# Altium schematic sheet 01_MICRO.SchDoc
size A3
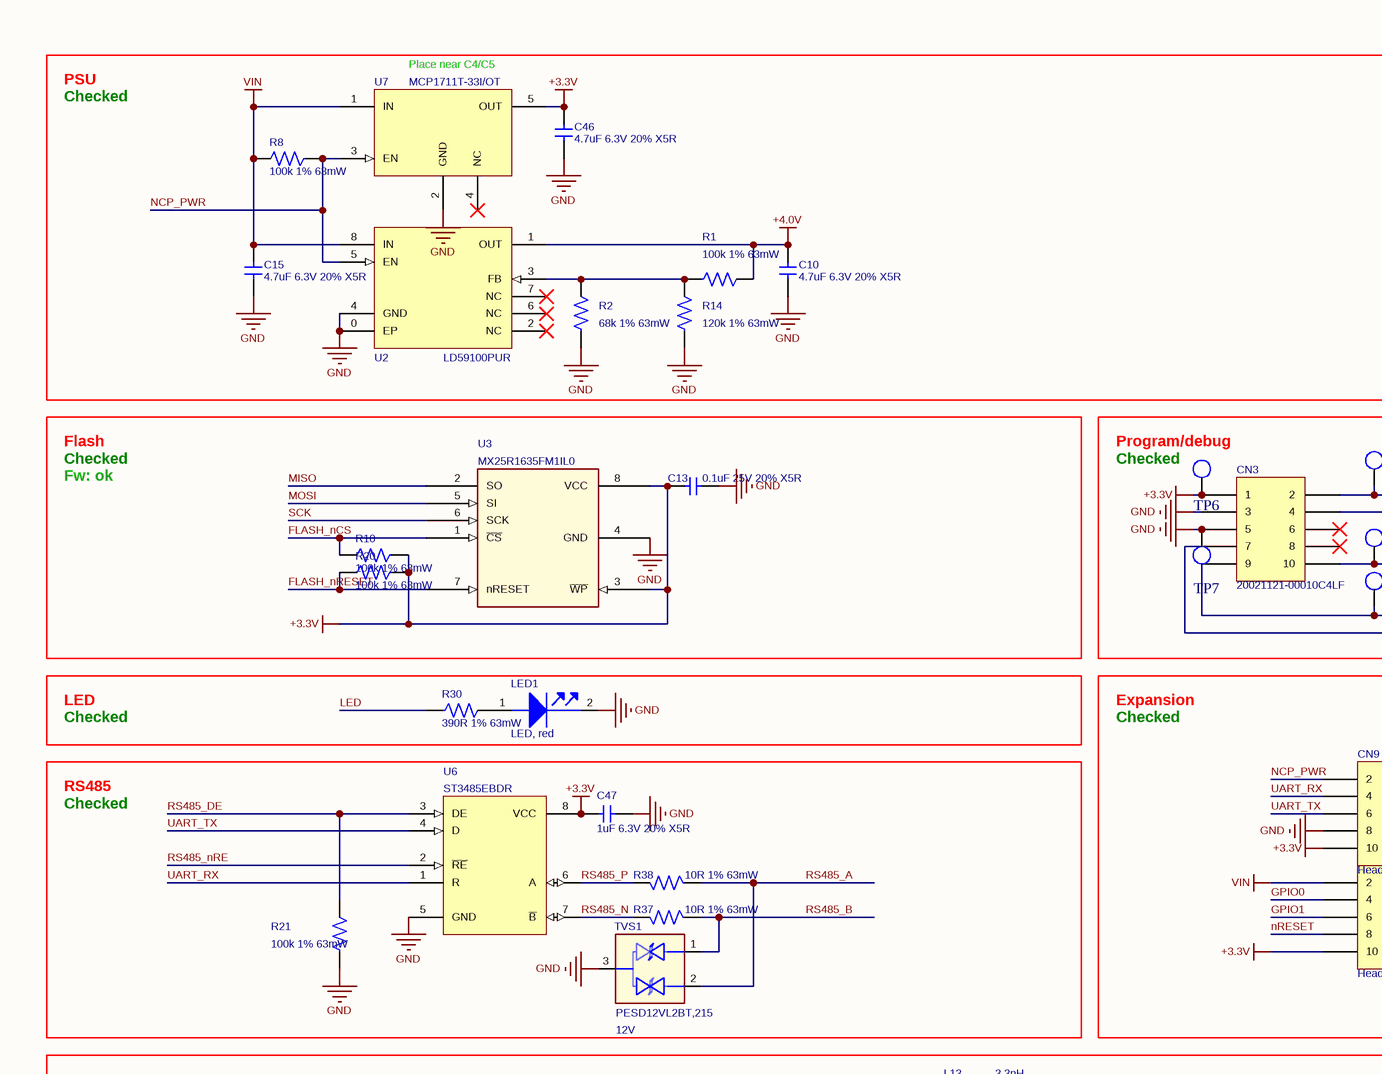
[diagram p0: 01_MICRO.SchDoc, top left]
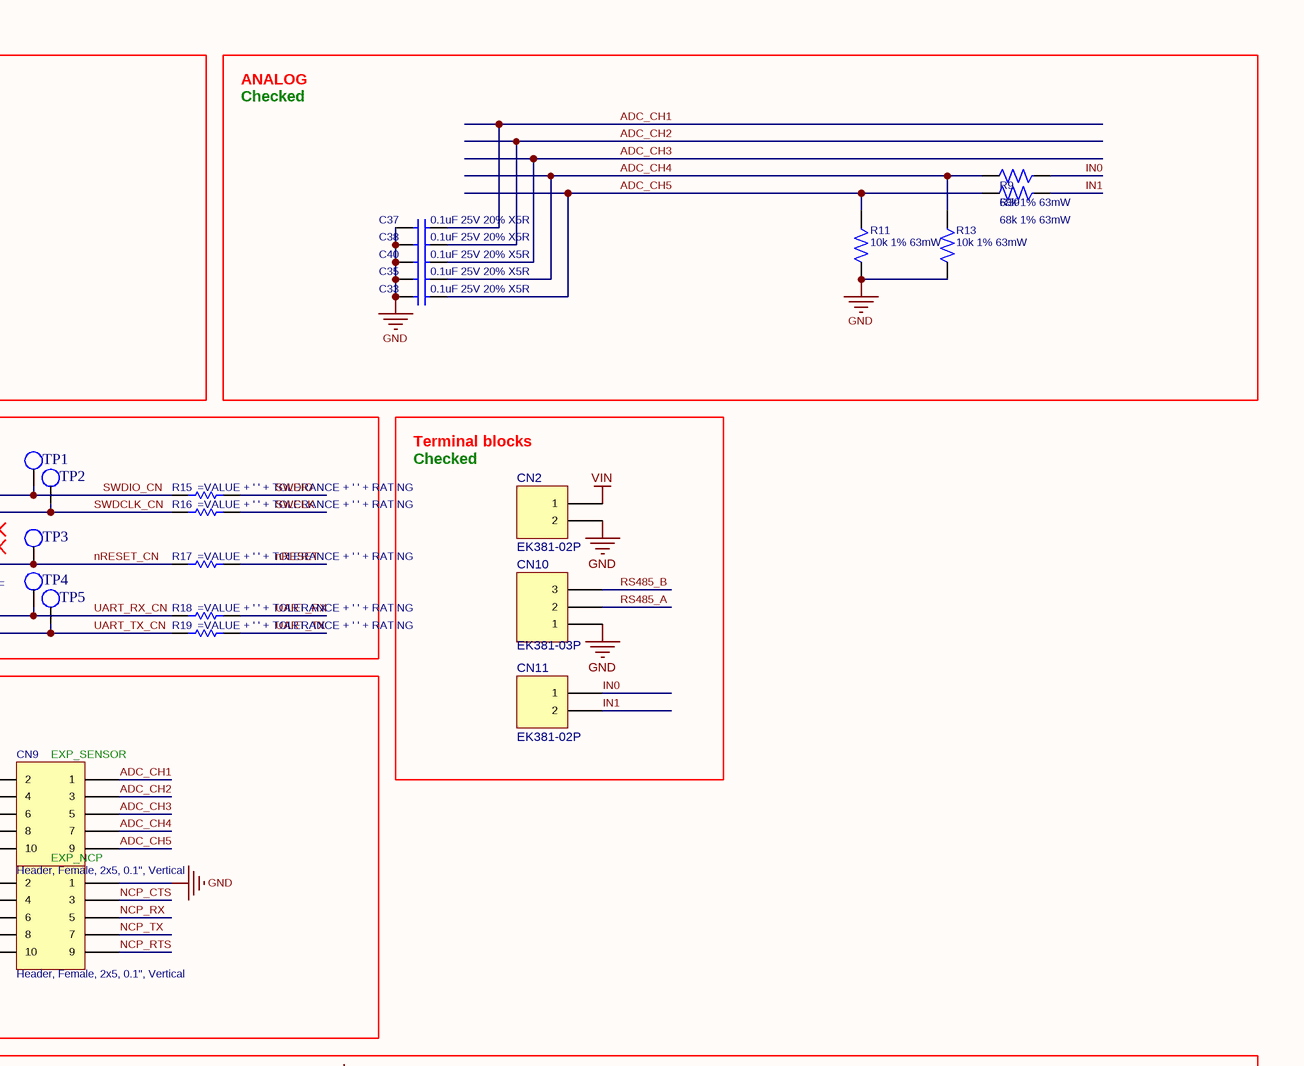
[diagram p1: 01_MICRO.SchDoc, top right]
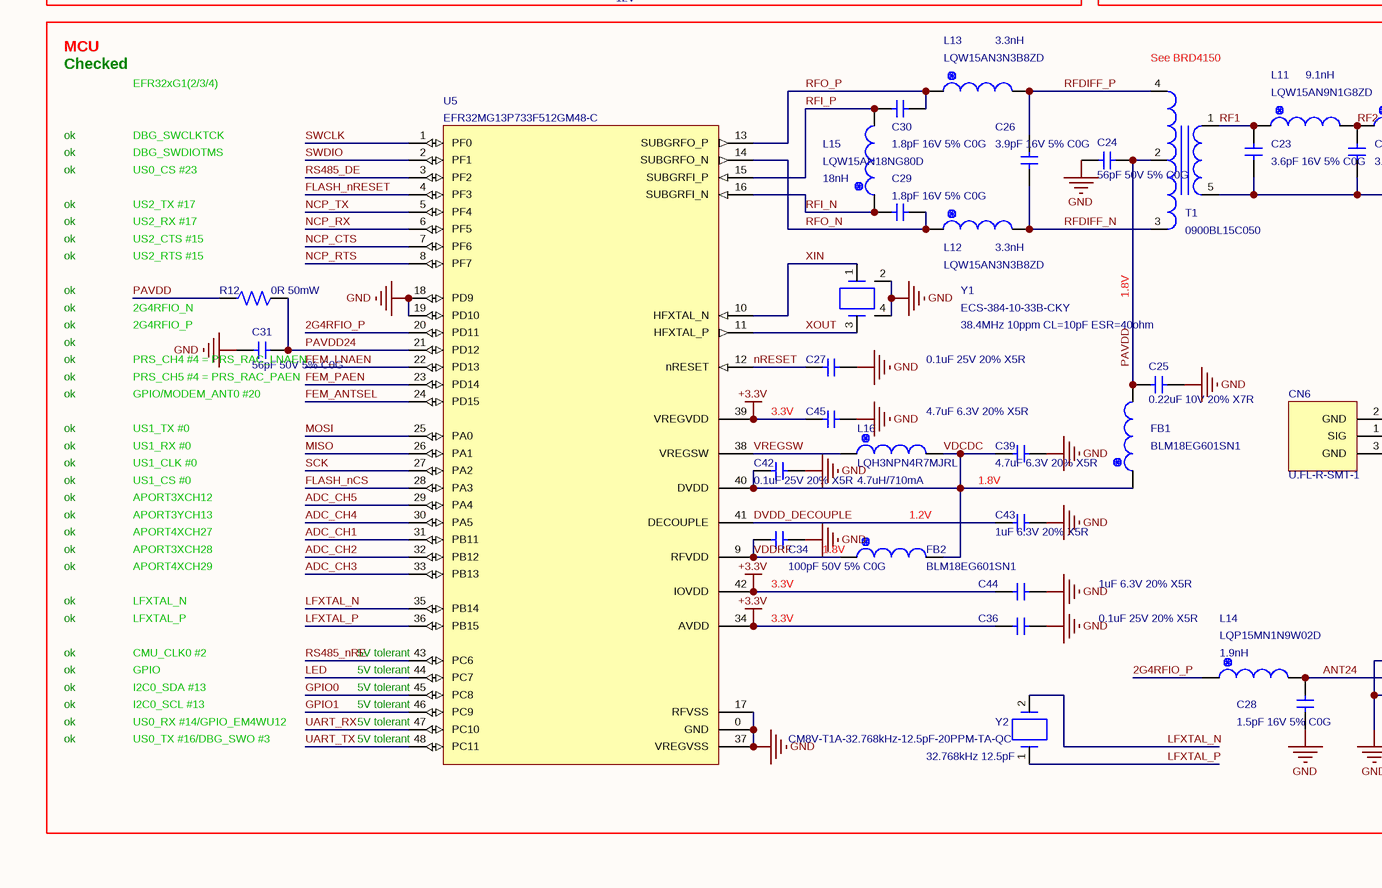
[diagram p2: 01_MICRO.SchDoc, bottom left]
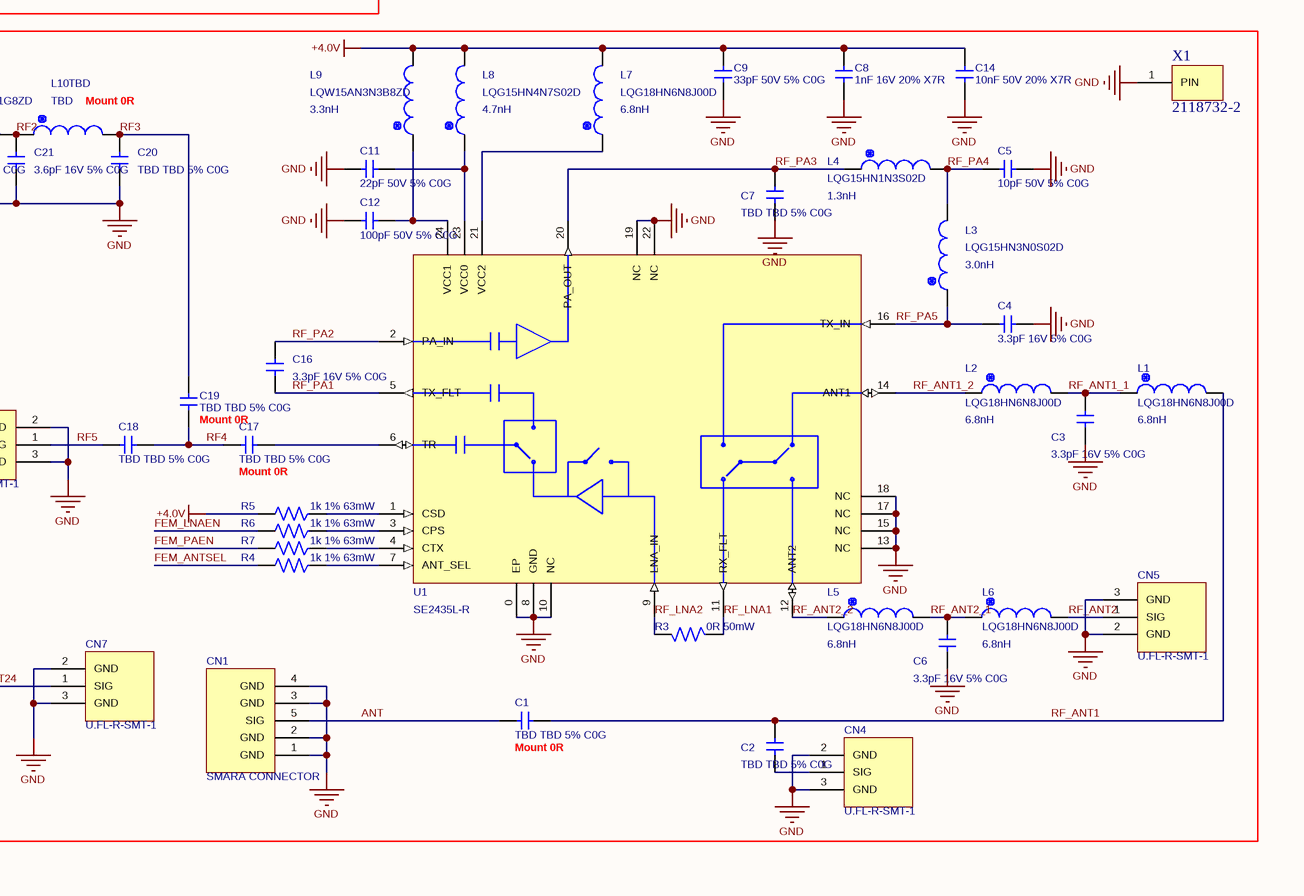
[diagram p3: 01_MICRO.SchDoc, bottom right]

## Parts
C1  TBD TBD 5% C0G  AssemblyComments: Mount 0R  [CAPC1005X55L]
C2  TBD TBD 5% C0G  [CAPC1005X55L]
C3  3.3pF 16V 5% C0G  [CAPC1005X55L]
C4  3.3pF 16V 5% C0G  [CAPC1005X55L]
C5  10pF 50V 5% C0G  [CAPC1005X55L]
C6  3.3pF 16V 5% C0G  [CAPC1005X55L]
C7  TBD TBD 5% C0G  [CAPC1005X55L]
C8  1nF 16V 20% X7R  [CAPC1005X55L]
C9  33pF 50V 5% C0G  [CAPC1005X55L]
C10  4.7uF 6.3V 20% X5R  [CAPC1608X90N]
C11  22pF 50V 5% C0G  [CAPC1005X55L]
C12  100pF 50V 5% C0G  [CAPC1005X55L]
C13  0.1uF 25V 20% X5R  [CAPC1005N]
C14  10nF 50V 20% X7R  [CAPC1005X55L]
C15  4.7uF 6.3V 20% X5R  [CAPC1608X90N]
C16  3.3pF 16V 5% C0G  [CAPC1005X55L]
C17  TBD TBD 5% C0G  AssemblyComments: Mount 0R  [CAPC1005X55L]
C18  TBD TBD 5% C0G  [CAPC1005X55L]
C19  TBD TBD 5% C0G  AssemblyComments: Mount 0R  [CAPC1005X55L]
C20  TBD TBD 5% C0G  [CAPC1005X55L]
C21  3.6pF 16V 5% C0G  [CAPC1005X55L]
C23  3.6pF 16V 5% C0G  [CAPC1005X55L]
C24  56pF 50V 5% C0G  [CAPC1005X55L]
C25  0.22uF 10V 20% X7R  [CAPC1005N]
C26  3.9pF 16V 5% C0G  [CAPC1005X55L]
C27  0.1uF 25V 20% X5R  [CAPC1005N]
C28  1.5pF 16V 5% C0G  [CAPC1005X55L]
C29  1.8pF 16V 5% C0G  [CAPC1005X55L]
C30  1.8pF 16V 5% C0G  [CAPC1005X55L]
C31  56pF 50V 5% C0G  [CAPC1005X55L]
C33  0.1uF 25V 20% X5R  [CAPC1005N]
C34  100pF 50V 5% C0G  [CAPC1005X55L]
C35  0.1uF 25V 20% X5R  [CAPC1005N]
C36  0.1uF 25V 20% X5R  [CAPC1005N]
C37  0.1uF 25V 20% X5R  [CAPC1005N]
C38  0.1uF 25V 20% X5R  [CAPC1005N]
C39  4.7uF 6.3V 20% X5R  [CAPC1608X90N]
C40  0.1uF 25V 20% X5R  [CAPC1005N]
C42  0.1uF 25V 20% X5R  [CAPC1005N]
C43  1uF 6.3V 20% X5R  [CAPC1005N]
C44  1uF 6.3V 20% X5R  [CAPC1005N]
C45  4.7uF 6.3V 20% X5R  [CAPC1608X90N]
C46  4.7uF 6.3V 20% X5R  [CAPC1608X90N]
C47  1uF 6.3V 20% X5R  [CAPC1005N]
CN1  SMARA CONNECTOR  [0733910320]
CN2  EK381-02P  [EK381-02P]
CN3  20021121-00010C4LF  [HDR2X5]
CN4  U.FL-R-SMT-1  [U.FL-R-SMT-1]
CN5  U.FL-R-SMT-1  [U.FL-R-SMT-1]
CN6  U.FL-R-SMT-1  [U.FL-R-SMT-1]
CN7  U.FL-R-SMT-1  [U.FL-R-SMT-1]
CN8  Header, Female, 2x5, 0.1", Vertical
CN9  Header, Female, 2x5, 0.1", Vertical
CN10  EK381-03P  [EK381-03P]
CN11  EK381-02P  [EK381-02P]
FB1  BLM18EG601SN1  [INDC1608X95N]
FB2  BLM18EG601SN1  [INDC1608X95N]
L1  LQG18HN6N8J00D  value 6.8nH  [INDC1608X95N]
L2  LQG18HN6N8J00D  value 6.8nH  [INDC1608X95N]
L3  LQG15HN3N0S02D  value 3.0nH  [INDC1005X55L]
L4  LQG15HN1N3S02D  value 1.3nH  [INDC1005X55L]
L5  LQG18HN6N8J00D  value 6.8nH  [INDC1608X95N]
L6  LQG18HN6N8J00D  value 6.8nH  [INDC1608X95N]
L7  LQG18HN6N8J00D  value 6.8nH  [INDC1608X95N]
L8  LQG15HN4N7S02D  value 4.7nH  [INDC1005X55L]
L9  LQW15AN3N3B8ZD  value 3.3nH  [INDC1005X55L]
L10  TBD  AssemblyComments: Mount 0R  [INDC1005X55L]
L11  LQW15AN9N1G8ZD  value 9.1nH  [INDC1005X55L]
L12  LQW15AN3N3B8ZD  value 3.3nH  [INDC1005X55L]
L13  LQW15AN3N3B8ZD  value 3.3nH  [INDC1005X55L]
L14  LQP15MN1N9W02D  value 1.9nH  [INDC1005X55L]
L15  LQW15AN18NG80D  value 18nH  [INDC1005X55L]
L16  LQH3NPN4R7MJRL  value 4.7uH/710mA  [INDW3030N]
LED1  LED, red  [LEDC2012N]
R1  100k 1% 63mW  [RESC1608X40N]
R2  68k 1% 63mW  [RESC1608X40N]
R3  0R 50mW  [RESC1005X40N]
R4  1k 1% 63mW  [RESC1608X40N]
R5  1k 1% 63mW  [RESC1608X40N]
R6  1k 1% 63mW  [RESC1608X40N]
R7  1k 1% 63mW  [RESC1608X40N]
R8  100k 1% 63mW  [RESC1608X40N]
R9  68k 1% 63mW  [RESC1608X40N]
R10  100k 1% 63mW  [RESC1608X40N]
R11  10k 1% 63mW  [RESC1608X40N]
R12  0R 50mW  [RESC1005X40N]
R13  10k 1% 63mW  [RESC1608X40N]
R14  120k 1% 63mW  [RESC1608X40N]
R15  (no value)  [RESC1608X40N]
R16  (no value)  [RESC1608X40N]
R17  (no value)  [RESC1608X40N]
R18  (no value)  [RESC1608X40N]
R19  (no value)  [RESC1608X40N]
R20  100k 1% 63mW  [RESC1608X40N]
R21  100k 1% 63mW  [RESC1608X40N]
R30  390R 1% 63mW  [RESC1608X40N]
R37  10R 1% 63mW  [RESC1608X40N]
R38  10R 1% 63mW  [RESC1608X40N]
R39  68k 1% 63mW  [RESC1608X40N]
T1  0900BL15C050  [BALC2012]
TP1  Test point  [TP]  (value not drawn)  (no BOM)
TP2  Test point  [TP]  (value not drawn)  (no BOM)
TP3  Test point  [TP]  (value not drawn)  (no BOM)
TP4  Test point  [TP]  (value not drawn)  (no BOM)
TP5  Test point  [TP]  (value not drawn)  (no BOM)
TP6  Test point  [TP]  (value not drawn)  (no BOM)
TP7  Test point  [TP]  (value not drawn)  (no BOM)
TVS1  PESD12VL2BT,215  value 12V  [SOT95P230X110-3N]
U1  SE2435L-R  [QFN50P400X400X90-25N]
U2  LD59100PUR  [SON65P300X300X90-9N-2]
U3  MX25R1635FM1IL0  [SOIC127P600X175-8N]
U5  EFR32MG13P733F512GM48-C  [QFN50P700X700X100-49N]
U6  ST3485EBDR  [SOIC127P600X175-8N]
U7  MCP1711T-33I/OT  [SOT95P284X122-5N]
X1  2118732-2  [2118732]
Y1  ECS-384-10-33B-CKY  value 38.4MHz 10ppm CL=10pF ESR=40ohm  [XTAL3225X60N]
Y2  CM8V-T1A-32.768kHz-12.5pF-20PPM-TA-QC  value 32.768kHz 12.5pF  [XTAL2.0x1.2]

## Nets
+3.3V: C13.1 C36.1 C44.1 C45.1 C46.1 C47.1 CN3.1 CN8.10 CN9.10 R10.1 R20.1 TP6.1 U3.3(~{WP}) U3.8(VCC) U5.34(AVDD) U5.39(VREGVDD) U5.42(IOVDD) U6.8(VCC) U7.5(OUT)
+4.0V: C8.2 C9.2 C10.1 C14.2 L7.2 L8.2 L9.2 R1.2 R5.2 U2.1(OUT)
GND: C3.1 C4.2 C5.2 C6.1 C7.2 C8.1 C9.1 C10.2 C11.1 C12.1 C13.2 C14.1 C15.2 C20.2 C21.2 C23.2 C24.1 C25.1 C27.1 C28.2 C31.1 C33.1 C34.1 C35.1 C36.2 C37.1 C38.1 C39.2 C40.1 C42.1 C43.2 C44.2 C45.2 C46.2 C47.2 CN1.1(GND) CN1.2(GND) CN1.3(GND) CN1.4(GND) CN2.2L(2) CN3.3 CN3.5 CN4.2(GND) CN4.3(GND) CN5.2(GND) CN5.3(GND) CN6.2(GND) CN6.3(GND) CN7.2(GND) CN7.3(GND) CN8.1 CN9.8 CN10.1L(1) LED1.2(ANODE) R2.1 R11.2 R13.2 R14.1 R21.1 T1.5 TP7.1 TVS1.3 U1.0(EP) U1.8(GND) U1.10(NC) U1.13(NC) U1.15(NC) U1.17(NC) U1.18(NC) U1.19(NC) U1.22(NC) U2.0(EP) U2.4(GND) U3.4(GND) U5.0(GND) U5.17(RFVSS) U5.18(PD9) U5.19(PD10) U5.37(VREGVSS) U6.5(GND) U7.2(GND) X1.1(PIN) Y1.2(GND) Y1.4(GND)
VIN: C15.1 CN2.1L(1) CN8.2 R8.2 U2.8(IN) U7.1(IN)
2G4RFIO_P: L14.1 U5.20(PD11)
ADC_CH1: C37.2 CN9.1 U5.31(PB11)
ADC_CH2: C38.2 CN9.3 U5.32(PB12)
ADC_CH3: C40.2 CN9.5 U5.33(PB13)
ADC_CH4: C35.2 CN9.7 R9.2 R13.1 U5.30(PA5)
ADC_CH5: C33.2 CN9.9 R11.1 R39.2 U5.29(PA4)
ANT: C1.1 CN1.5(SIG)
ANT24: C28.1 CN7.1(SIG) L14.2
DVDD_DECOUPLE: C43.1 U5.41(DECOUPLE)
FEM_ANTSEL: R4.2 U5.24(PD15)
FEM_LNAEN: R6.2 U5.22(PD13)
FEM_PAEN: R7.2 U5.23(PD14)
FLASH_nCS: R10.2 U3.1(~{CS}) U5.28(PA3)
FLASH_nRESET: R20.2 U3.7(nRESET) U5.4(PF3)
GPIO0: CN8.4 U5.45(PC8)
GPIO1: CN8.6 U5.46(PC9)
IN0: CN11.1L(1) R9.1
IN1: CN11.2L(2) R39.1
LED: R30.1 U5.44(PC7)
LFXTAL_N: U5.35(PB14) Y2.2(S2)
LFXTAL_P: U5.36(PB15) Y2.1(S1)
MISO: U3.2(SO) U5.26(PA1)
MOSI: U3.5(SI) U5.25(PA0)
NCP_CTS: CN8.3 U5.7(PF6)
NCP_PWR: CN9.2 R8.1 U2.5(EN) U7.3(EN)
NCP_RTS: CN8.9 U5.8(PF7)
NCP_RX: CN8.5 U5.6(PF5)
NCP_TX: CN8.7 U5.5(PF4)
nRESET: C27.2 CN8.8 R17.2 U5.12(nRESET)
nRESET_CN: CN3.10 R17.1 TP3.1
PAVDD: C24.2 C25.2 FB1.2 R12.1 T1.2
PAVDD24: C31.2 R12.2 U5.21(PD12)
RF1: C23.1 L11.1 T1.1
RF2: C21.1 L10.1 L11.2
RF3: C19.1 C20.1 L10.2
RF4: C17.2 C18.1 C19.2
RF5: C18.2 CN6.1(SIG)
RF_ANT1: C1.2 C2.1 L1.2
RF_ANT1_1: C3.2 L1.1 L2.2
RF_ANT1_2: L2.1 U1.14(ANT1)
RF_ANT2: CN5.1(SIG) L6.2
RF_ANT2_1: C6.2 L5.2 L6.1
RF_ANT2_2: L5.1 U1.12(ANT2)
RF_LNA1: R3.1 U1.11(RX_FLT)
RF_LNA2: R3.2 U1.9(LNA_IN)
RF_PA1: C16.2 U1.5(TX_FLT)
RF_PA2: C16.1 U1.2(PA_IN)
RF_PA3: C7.1 L4.1 U1.20(PA_OUT)
RF_PA4: C5.1 L3.2 L4.2
RF_PA5: C4.1 L3.1 U1.16(TX_IN)
RFDIFF_N: C26.2 L12.2 T1.3
RFDIFF_P: C26.1 L13.2 T1.4
RFI_N: C29.2 L15.1 U5.16(SUBGRFI_N)
RFI_P: C30.2 L15.2 U5.15(SUBGRFI_P)
RFO_N: C29.1 L12.1 U5.14(SUBGRFO_N)
RFO_P: C30.1 L13.1 U5.13(SUBGRFO_P)
RS485_A: CN10.2L(2) R38.1 TVS1.2
RS485_B: CN10.3L(3) R37.1 TVS1.1
RS485_DE: R21.2 U5.3(PF2) U6.3(DE)
RS485_N: R37.2 U6.7(~{B})
RS485_nRE: U5.43(PC6) U6.2(~{RE})
RS485_P: R38.2 U6.6(A)
SCK: U3.6(SCK) U5.27(PA2)
SWCLK: R16.2 U5.1(PF0)
SWDCLK_CN: CN3.4 R16.1 TP2.1
SWDIO: R15.2 U5.2(PF1)
SWDIO_CN: CN3.2 R15.1 TP1.1
UART_RX: CN9.4 R18.2 U5.47(PC10) U6.1(R)
UART_RX_CN: CN3.9 R18.1 TP4.1
UART_TX: CN9.6 R19.2 U5.48(PC11) U6.4(D)
UART_TX_CN: CN3.7 R19.1 TP5.1
VDCDC: C39.1 C42.2 FB1.1 FB2.2 L16.2 U5.40(DVDD)
VDDRF: C34.2 FB2.1 U5.9(RFVDD)
VREGSW: L16.1 U5.38(VREGSW)
XIN: U5.10(HFXTAL_N) Y1.1(S1)
XOUT: U5.11(HFXTAL_P) Y1.3(S2)
NetC2_2: C2.2 CN4.1(SIG)
NetC11_2: C11.2 L8.1 U1.23(VCC0)
NetC12_2: C12.2 L9.1 U1.24(VCC1)
NetC17_1: C17.1 U1.6(TR)
NetL7_1: L7.1 U1.21(VCC2)
NetLED1_1: LED1.1(CATHODE) R30.2
NetR1_1: R1.1 R2.2 R14.2 U2.3(FB)
NetR4_1: R4.1 U1.7(ANT_SEL)
NetR5_1: R5.1 U1.1(CSD)
NetR6_1: R6.1 U1.3(CPS)
NetR7_1: R7.1 U1.4(CTX)

Not connected (* = marked no-connect by the designer): CN3 6* 8*; U2 2(NC)* 6(NC)* 7(NC)*; U7 4(NC)*

## Notes on the sheet
- PSU
- Checked
- (near U7) Place near C4/C5
- ANALOG
- Flash
- Fw: ok
- (near TP6) Program/debug
- (near TP6) Checked
- (near CN2) Terminal blocks
- LED
- Expansion
- RS485
- (near CN9) EXP_SENSOR
- (near CN9) EXP_NCP
- MCU
- (near T1) See BRD4150
- ok
- DBG_SWCLKTCK
- EFR32xG1(2/3/4)
- DBG_SWDIOTMS
- US2_RX #17
- US2_TX #17
- US0_CS #23
- 2G4RFIO_N
- (near R12) US2_CTS #15
- (near R12) US2_RTS #15
- 1.8V
- 2G4RFIO_P
- (near C31) PRS_CH4 #4 = PRS_RAC_LNAEN
- (near C31) PRS_CH5 #4 = PRS_RAC_PAEN
- (near C31) GPIO/MODEM_ANT0 #20
- US1_CLK #0
- US1_CS #0
- US1_RX #0
- US1_TX #0
- 3.3V
- APORT4XCH29
- APORT4XCH27
- APORT3XCH28
- APORT3XCH12
- APORT3YCH13
- (near FB2) 1.8V
- 1.2V
- LFXTAL_N
- LFXTAL_P
- CMU_CLK0 #2
- (near U5) 5V tolerant
- I2C0_SDA #13
- I2C0_SCL #13
- US0_RX #14/GPIO_EM4WU12
- US0_TX #16/DBG_SWO #3
- GPIO

## Library data of the parts
C1 C2 C7 C17-C20 = C_Dup1: Capacitor, ceramic; MFG: <GENERIC>; FP_DESC: C0402; Symbol Checked: Ok; Replacement Allowed: Yes; MFG_PN: <GENERIC>; Footprint Checked: Assign OK, Footprint OK; MATERIAL: C0G; TOLERANCE: 5%; VALUE: TBD; VOLTAGE: TBD
C3 C4 C6 C16 = C_Dup1: Capacitor, ceramic; MFG: YAGEO; MFG_PN: CC0402BRNPO9BN3R3; FP_DESC: C0402; Symbol Checked: Ok; Replacement Allowed: Ask; Footprint Checked: Assign OK, Footprint OK; MATERIAL: C0G; TOLERANCE: 5%; VALUE: 3.3pF; VOLTAGE: 16V
C5 = C_Dup1: Capacitor, ceramic; MFG: SAMSUNG; MFG_PN: CL05C100DB5NNNC; FP_DESC: C0402; Symbol Checked: Ok; Replacement Allowed: Ask; Footprint Checked: Assign OK, Footprint OK; MATERIAL: C0G; TOLERANCE: 5%; VALUE: 10pF; VOLTAGE: 50V
C8 = C_Dup1: Capacitor, ceramic; MFG: SAMSUNG; MFG_PN: CL05B102KO5NNNC; FP_DESC: C0402; Symbol Checked: Ok; Replacement Allowed: Ask; Footprint Checked: Assign OK, Footprint OK; MATERIAL: X7R; TOLERANCE: 20%; VALUE: 1nF; VOLTAGE: 16V
C9 = C_Dup1: Capacitor, ceramic; MFG: SAMSUNG; MFG_PN: CL05C330JB5NNNC; FP_DESC: C0402; Symbol Checked: Ok; Replacement Allowed: Ask; Footprint Checked: Assign OK, Footprint OK; MATERIAL: C0G; TOLERANCE: 5%; VALUE: 33pF; VOLTAGE: 50V
C10 C15 C39 C45 C46 = C_Dup1: Capacitor, ceramic; MFG: SAMSUNG; MFG_PN: CL10A475MQ8NNNC; FP_DESC: C0603; Symbol Checked: Ok; Replacement Allowed: Ask; Footprint Checked: Assign OK, Footprint OK; MATERIAL: X5R; TOLERANCE: 20%; VALUE: 4.7uF; VOLTAGE: 6.3V
C11 = C_Dup1: Capacitor, ceramic; MFG: SAMSUNG; MFG_PN: CL05C220JB5NNNC; FP_DESC: C0402; Symbol Checked: Ok; Replacement Allowed: Ask; Footprint Checked: Assign OK, Footprint OK; MATERIAL: C0G; TOLERANCE: 5%; VALUE: 22pF; VOLTAGE: 50V
C12 = C_Dup1: Capacitor, ceramic; MFG: SAMSUNG; MFG_PN: CL05C101JB5NNNC; FP_DESC: C0402; Symbol Checked: Ok; Replacement Allowed: Ask; Footprint Checked: Assign OK, Footprint OK; MATERIAL: C0G; TOLERANCE: 5%; VALUE: 100pF; VOLTAGE: 50V
C13 C27 C33 C35-C38 C40 C42 = C_Dup1: Capacitor, ceramic; MFG_PN: CL05A104KA5NNNC; MFG: SAMSUNG; FP_DESC: C0402; Symbol Checked: Ok; Replacement Allowed: Ask; Footprint Checked: Assign OK, Footprint OK; MATERIAL: X5R; TOLERANCE: 20%; VALUE: 0.1uF; VOLTAGE: 25V
C14 = C_Dup1: Capacitor, ceramic; MFG: SAMSUNG; MFG_PN: CL05B103KB5NNNC; FP_DESC: C0402; Symbol Checked: Ok; Replacement Allowed: Ask; Footprint Checked: Assign OK, Footprint OK; MATERIAL: X7R; TOLERANCE: 20%; VALUE: 10nF; VOLTAGE: 50V
C21 C23 = C_Dup1: Capacitor, ceramic; MFG: YAGEO; MFG_PN: CC0402BRNPO9BN3R6; FP_DESC: C0402; Symbol Checked: Ok; Replacement Allowed: Ask; Footprint Checked: Assign OK, Footprint OK; MATERIAL: C0G; TOLERANCE: 5%; VALUE: 3.6pF; VOLTAGE: 16V
C24 C31 = C_Dup1: Capacitor, ceramic; MFG: SAMSUNG; MFG_PN: CL05C560JB5NNNC; FP_DESC: C0402; Symbol Checked: Ok; Replacement Allowed: Ask; Footprint Checked: Assign OK, Footprint OK; MATERIAL: C0G; TOLERANCE: 5%; VALUE: 56pF; VOLTAGE: 50V
C25 = C_Dup1: Capacitor, ceramic; MFG_PN: CL05B224KP5NNNC; MFG: SAMSUNG; FP_DESC: C0402; Symbol Checked: Ok; Replacement Allowed: Ask; Footprint Checked: Assign OK, Footprint OK; MATERIAL: X7R; TOLERANCE: 20%; VALUE: 0.22uF; VOLTAGE: 10V
C26 = C_Dup1: Capacitor, ceramic; MFG: YAGEO; MFG_PN: CC0402BRNPO9BN3R9; FP_DESC: C0402; Symbol Checked: Ok; Replacement Allowed: Ask; Footprint Checked: Assign OK, Footprint OK; MATERIAL: C0G; TOLERANCE: 5%; VALUE: 3.9pF; VOLTAGE: 16V
C28 = C_Dup1: Capacitor, ceramic; MFG: YAGEO; MFG_PN: CC0402CRNPO9BN1R5; FP_DESC: C0402; Symbol Checked: Ok; Replacement Allowed: Ask; Footprint Checked: Assign OK, Footprint OK; MATERIAL: C0G; TOLERANCE: 5%; VALUE: 1.5pF; VOLTAGE: 16V
C29 C30 = C_Dup1: Capacitor, ceramic; MFG: YAGEO; MFG_PN: CC0402BRNPO9BN1R8; FP_DESC: C0402; Symbol Checked: Ok; Replacement Allowed: Ask; Footprint Checked: Assign OK, Footprint OK; MATERIAL: C0G; TOLERANCE: 5%; VALUE: 1.8pF; VOLTAGE: 16V
C34 = C_Dup1: Capacitor, ceramic; MFG_PN: CL05C101JB5NNNC; MFG: SAMSUNG; FP_DESC: C0402; Symbol Checked: Ok; Replacement Allowed: Ask; Footprint Checked: Assign OK, Footprint OK; MATERIAL: C0G; TOLERANCE: 5%; VALUE: 100pF; VOLTAGE: 50V
C43 C44 C47 = C_Dup1: Capacitor, ceramic; MFG: SAMSUNG; MFG_PN: CL05A105KQ5NNNC; FP_DESC: C0402; Symbol Checked: Ok; Replacement Allowed: Ask; Footprint Checked: Assign OK, Footprint OK; MATERIAL: X5R; TOLERANCE: 20%; VALUE: 1uF; VOLTAGE: 6.3V
CN1 = RPSMA: SMA, Right angle; MFG: LPRS; Symbol Checked: Ok; Replacement Allowed: Ask; FP_DESC: SMA, Right angle; MFG_PN: SMARA CONNECTOR; Footprint Checked: Assign OK, Footprint OK
CN2 CN11 = Header 2: Header, 2-Pin; FP_DESC: Terminal block, Male, 2-pin; MFG: DINKLE; Symbol Checked: Ok; Replacement Allowed: Ask; Footprint Checked: Assign OK, Footprint OK; MFG_PN: EK381-02P
CN3 = Header 5X2: Connector Header Surface Mount 10 position 0.050" (1.27mm); Symbol Checked: Ok; MFG: AMPHENOL; Replacement Allowed: Ask; Footprint Checked: Assign Ok, Footprint Ok; MFG_PN: 20021121-00010C4LF; FP_DESC: HDR2x5
CN4-CN7 = U.FL-R-SMT-1: Ultra Small Surface Mount Coaxial Connectors - 1.9mm or 2.4mm Mated Height; MFG: HIROSE; FP_DESC: U.FL connector; Symbol Checked: Ok; Replacement Allowed: Ask; MFG_PN: U.FL-R-SMT-1; Footprint Checked: Assign OK, Footprint OK
CN8 CN9 = Header 5X2: Symbol Checked: Ok; MFG: <GENERIC>; Replacement Allowed: Yes; Footprint Checked: Assign Ok, Footprint Ok; MFG_PN: <GENERIC>; FP_DESC: Header, Female, 2x5, 0.1", Vertical
CN10 = Header 3: Header, 3-Pin; FP_DESC: Terminal block, Male, 3-pin; MFG: DINKLE; Symbol Checked: Ok; Replacement Allowed: Ask; Footprint Checked: Assign OK, Footprint OK; MFG_PN: EK381-03P
FB1 FB2 = L: Ferrite bead; MFG: MURATA; FP_DESC: L0603; Symbol Checked: Ok; VALUE: 600Ohms@100MHz; Replacement Allowed: No; MFG_PN: BLM18EG601SN1; Footprint Checked: Assign OK, Footprint OK
L1 L2 L5-L7 = L: Inductor; MFG: MURATA; FP_DESC: L0603; Symbol Checked: Ok; TOLERANCE: TBD%; Replacement Allowed: No; MFG_PN: LQG18HN6N8J00D; Footprint Checked: Assign OK, Footprint OK
L3 L4 L8 L9 L11-L15 = L: Inductor; MFG: MURATA; FP_DESC: L0402; Symbol Checked: Ok; TOLERANCE: TBD%; Replacement Allowed: No; Footprint Checked: Assign OK, Footprint OK
  L3: MFG_PN: LQG15HN3N0S02D
  L4: MFG_PN: LQG15HN1N3S02D
  L8: MFG_PN: LQG15HN4N7S02D
  L9 L12 L13: MFG_PN: LQW15AN3N3B8ZD
  L11: MFG_PN: LQW15AN9N1G8ZD
  L14: MFG_PN: LQP15MN1N9W02D
  L15: MFG_PN: LQW15AN18NG80D
L10 = L: Inductor; FP_DESC: L0402; Symbol Checked: Ok; TOLERANCE: TBD%; Replacement Allowed: Yes; MFG: TBD; MFG_PN: TBD; Footprint Checked: Assign OK, Footprint OK; VALUE: TBD
L16 = L: Inductor; MFG: MURATA; FP_DESC: Inductor, 3.0x3.0, H=1.2; Symbol Checked: Ok; TOLERANCE: TBD%; Replacement Allowed: No; MFG_PN: LQH3NPN4R7MJRL; Footprint Checked: Assign OK, Footprint OK
LED1 = Led Red HSMC-C170: MFG_PN: <GENERIC>; FP_DESC: LED0805; Symbol Checked: Ok; Replacement Allowed: Yes; MFG: <GENERIC>; Footprint Checked: Assign OK, Footprint OK
R1 R2 R4-R11 R13 R14 R20 R21 R30 R37-R39 = R: Resistor, SMD; MFG_PN: <GENERIC>; FP_DESC: R0603; Symbol Checked: Ok; Replacement Allowed: Yes; MFG: <GENERIC>; Footprint Checked: Assign OK, Footprint OK; TOLERANCE: 1%; POWER: 63mW
  R1 R8 R10 R20 R21: VALUE: 100k
  R2 R9 R39: VALUE: 68k
  R4-R7: VALUE: 1k
  R11 R13: VALUE: 10k
  R14: VALUE: 120k
  R30: VALUE: 390R
  R37 R38: VALUE: 10R
R3 R12 = R: Resistor, SMD; MFG_PN: <GENERIC>; FP_DESC: R0402; Symbol Checked: Ok; Replacement Allowed: Yes; MFG: <GENERIC>; Footprint Checked: Assign OK, Footprint OK; VALUE: 0R; POWER: 50mW
R15-R19 = Res: Resistor, SMD; MFG_PN: <GENERIC>; FP_DESC: R0603; TOLERANCE: 1%; Value: 47R; Symbol Checked: Ok; Replacement Allowed: Yes; POWER: 63mW; MFG: <GENERIC>; Footprint Checked: Assign Ok, Footprint Ok
T1 = BALUN: 50:50 ohms Balun; MFG: JOHANSON; FP_DESC: 0805 Balun; Symbol Checked: Ok; Replacement Allowed: No; Footprint Checked: Assign OK, Footprint OK; MFG_PN: 0900BL15C050
TP1-TP7 = TP
TVS1 = NUP2105L: TVS array; MFG: NXP; FP_DESC: SOT23-3; Symbol Checked: Ok; Replacement Allowed: No; MFG_PN: PESD12VL2BT,215; Footprint Checked: Assign OK, Footprint OK
U1 = SE2435L: 860 to 930 MHz High-Power RF Front-End Module; FP_DESC: QFN24+TAB; MFG: SKYWORKS; Symbol Checked: Ok; Replacement Allowed: No; Footprint Checked: Assign OK, Footprint OK; MFG_PN: SE2435L-R
U2 = LD59100: 1A ultra low-dropout regulator with reverse current protection; FP_DESC: VDFN-8; MFG: ST; Symbol Checked: Ok; Replacement Allowed: No; Footprint Checked: Assign OK, Footprint OK; MFG_PN: LD59100PUR
U3 = AT45DB321C_CNC_0: 2.5V/3.0V 16 Mbit Serial Quad I/O (SQI) Flash Memory; MFG: MACRONIX; FP_DESC: SOIC8; Symbol Checked: Ok; Replacement Allowed: No; MFG_PN: MX25R1635FM1IL0; Footprint Checked: Assign OK, Footprint OK
U5 = EFR32xG1_2.4G_SUBGHZ_QFN48: Mighty Gecko Multi-Protocol Wireless SoC Family Data Sheet; FP_DESC: QFN48; MFG: SILABS; Symbol Checked: Ok; Replacement Allowed: No; Footprint Checked: Assign OK, Footprint OK; MFG_PN: EFR32MG13P733F512GM48-C
U6 = SN75176BD: Differential Bus Transceiver; FP_DESC: SOIC-8; MFG: ST; Symbol Checked: Ok; Replacement Allowed: No; MFG_PN: ST3485EBDR; Footprint Checked: Assign OK, Footprint OK
U7 = XC6504: Linear Voltage Regulator IC  1 Output  150mA SOT-25-5; MFG: MICROCHIP; FP_DESC: SOT23-5; Symbol Checked: Ok; Replacement Allowed: No; MFG_PN: MCP1711T-33I/OT; Footprint Checked: Assign Ok, Footprint Ok
X1 = NO_PINS: RF SHIELD 1.5" X 2" SMD; MFG: TE; Symbol Checked: Ok; Replacement Allowed: Ask; Footprint Checked: Assign OK, Footprint OK; FP_DESC: RF SHIELD 1.5" X 2" SMD; MFG_PN: 2118732-2
Y1 = CS10-12MHz: Crystal; MFG: ECS; FP_DESC: XTAL 3.2x2.5; Symbol Checked: Ok; Replacement Allowed: No; Footprint Checked: Assign OK, Footprint OK; MFG_PN: ECS-384-10-33B-CKY
Y2 = CS10-12MHz: Crystal; MFG: MICRO CRYSTAL AG; FP_DESC: XTAL 2.0x1.2; Symbol Checked: Ok; Replacement Allowed: No; MFG_PN: CM8V-T1A-32.768kHz-12.5pF-20PPM-TA-QC; Footprint Checked: Assign OK, Footprint OK